# EAGLE design mini-meter-revb (EAGLE 6.5.0)
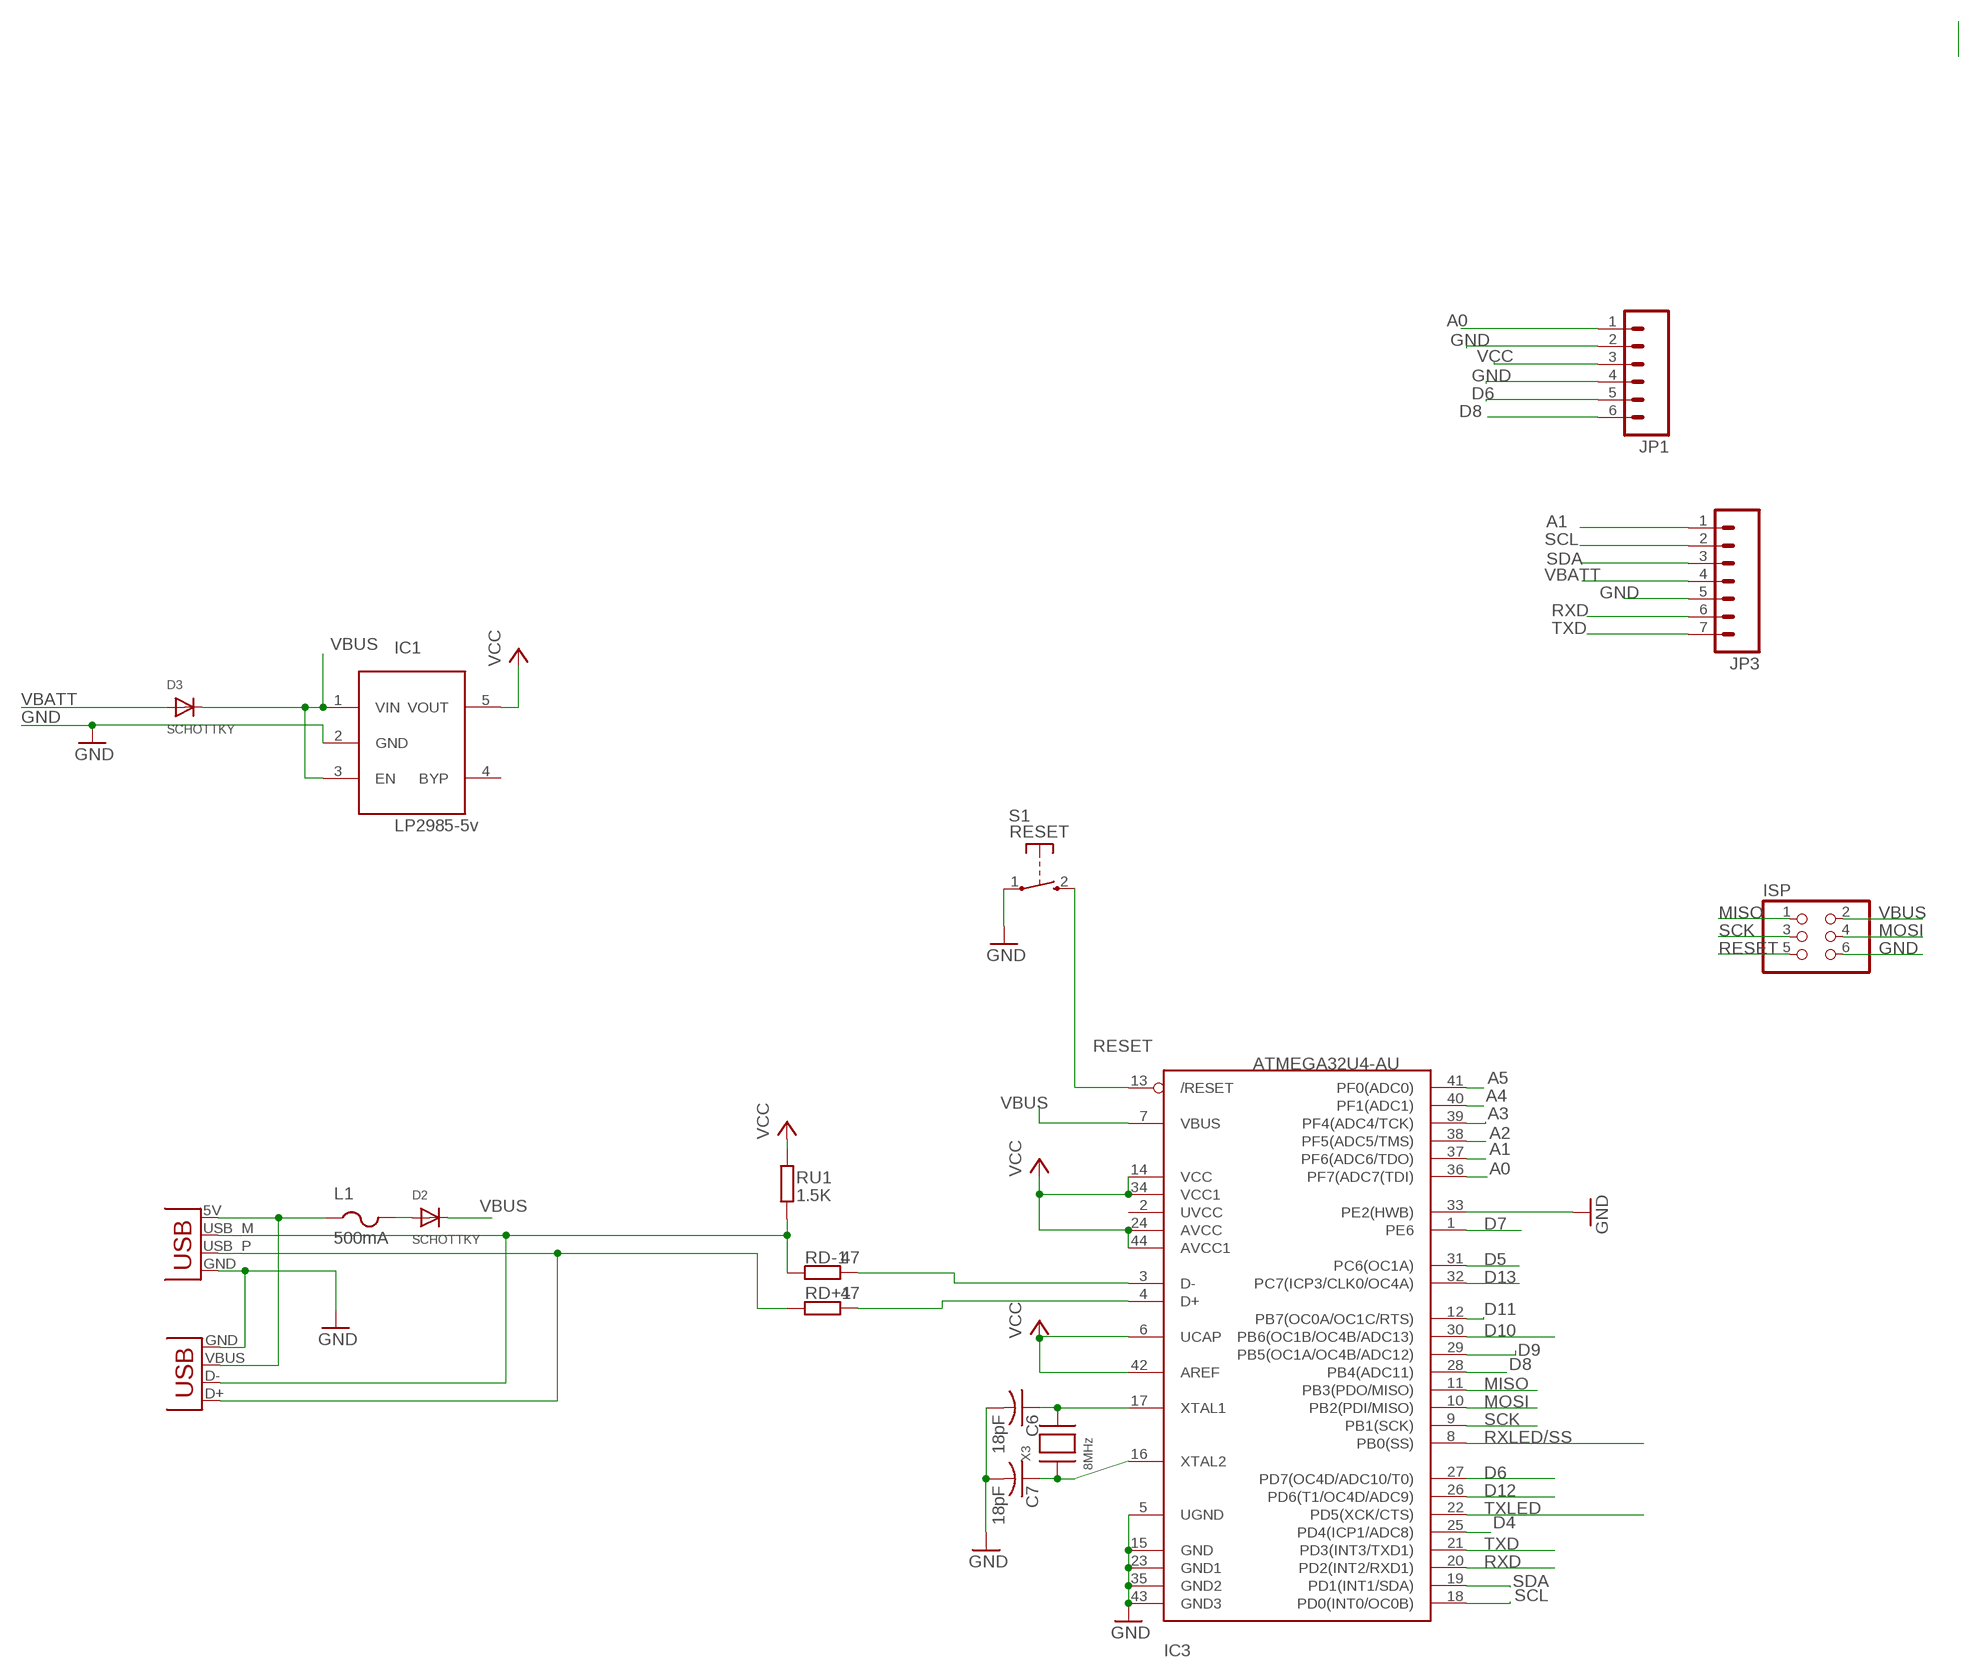
[diagram p0: schematic, sheet 1]

## Parts
C6  18pF  C-USC0805K  [C0805K]
C7  18pF  C-USC0805K  [C0805K]
D2  SCHOTTKY  DIODESOD-123  [SOD-123]
D3  SCHOTTKY  DIODESOD-123  [SOD-123]
IC1  LP2985-5v  LP298XS  [SOT23-5L]
IC3  ATMEGA32U4-AU  [TQFP44]
ISP  PINHD-2X3  [2X03]
JP1  M06LOCK  [1X06_LOCK]
JP3  M07LOCK  [1X07_LOCK]
L1  500mA  PTCFUSE-1206  [R1206]
P1  USBPCB  [USB-A-PCB]
RD+1  47  R-EU_R0805  [R0805]
RD-1  47  R-EU_R0805  [R0805]
RU1  1.5K  R-EU_R0805  [R0805]
S1  RESET  TAC_SWITCH_2PIN  [TACTILE_SWITCH_SMD_2PIN_TINY]
X2  USBSMD  [USB-MINIB]
X3  8MHz  XTALNX5032  [NX5032]

## Nets
A0: IC3.36(PF7(ADC7(TDI)) JP1.1
A1: IC3.37(PF6(ADC6/TDO)) JP3.1
A2: IC3.38(PF5(ADC5/TMS))
A3: IC3.39(PF4(ADC4/TCK))
A4: IC3.40(PF1(ADC1))
A5: IC3.41(PF0(ADC0))
D4: IC3.25(PD4(ICP1/ADC8))
D5: IC3.31(PC6(OC1A))
D6: IC3.27(PD7(OC4D/ADC10/T0)) JP1.5
D7: IC3.1(PE6)
D8: IC3.28(PB4(ADC11)) JP1.6
D9: IC3.29(PB5(OC1A/OC4B/ADC12))
D10: IC3.30(PB6(OC1B/OC4B/ADC13))
D11: IC3.12(PB7(OC0A/OC1C/RTS))
D12: IC3.26(PD6(T1/OC4D/ADC9))
D13: IC3.32(PC7(ICP3/CLK0/OC4A))
D-: P1.USB_M(D-) RD-1.1 RU1.1 X2.D-
GND: C6.2 C7.2 IC1.2(GND) IC3.5(UGND) IC3.15(GND) IC3.23(GND1) IC3.33(PE2(HWB)) IC3.35(GND2) IC3.43(GND3) ISP.6 JP1.2 JP1.4 JP3.5 P1.GND S1.1(P) X2.GND
MISO: IC3.11(PB3(PDO/MISO)) ISP.1
MOSI: IC3.10(PB2(PDI/MISO)) ISP.4
N$1: D2.A L1.2
N$2: C7.1 IC3.16(XTAL2) X3.P$1
N$3: C6.1 IC3.17(XTAL1) X3.P$2
N$4: P1.USB_P(D+) RD+1.1 X2.D+
N$21: IC3.4(D+) RD+1.2
N$22: IC3.3(D-) RD-1.2
RESET: IC3.13(/RESET) ISP.5 S1.2(S)
RXD: IC3.20(PD2(INT2/RXD1)) JP3.6
RXLED/SS: IC3.8(PB0(SS))
SCK: IC3.9(PB1(SCK)) ISP.3
SCL: IC3.18(PD0(INT0/OC0B)) JP3.2
SDA: IC3.19(PD1(INT1/SDA)) JP3.3
TXD: IC3.21(PD3(INT3/TXD1)) JP3.7
TXLED: IC3.22(PD5(XCK/CTS))
VBATT: D3.A JP3.4
VBUS: D2.C D3.C IC1.1(VIN) IC1.3(EN) IC3.7(VBUS) ISP.2
VBUS1: L1.1 P1.5V(VBUS) X2.VBUS
VCC: IC1.5(VOUT) IC3.6(UCAP) IC3.14(VCC) IC3.24(AVCC) IC3.34(VCC1) IC3.42(AREF) IC3.44(AVCC1) JP1.3 RU1.2
Unconnected: IC1.4(BYP) IC3.2(UVCC)

## Library data of the parts
C6 C7 = adafruit:C-US: CAPACITOR, American symbol
D2 D3 = adafruit:DIODE: Diode SMADIODE - SMA Surface Mount Package 20V 1A Schottky Diode Digikey: 641-1014-6-ND DO-1N4148 - Through Hole Small Current Diode SOD-123 20V 1 A (.5mV Vf) Schottky Diode - Digikey: MBRX120TPMSCT-ND SOD-323 10V 570mA (.38mV Vf, 3ns) Schottky Diode - Digikey: ZLLS410CT-ND SOD-523 30V 30mA Schottky Diode (RB751S-40TE61) - Digikey: RB751S-40TE61CT-ND SOT23-R/W - SOT23 Package (R = Solder Paste/Reflow Ovens, W = Hand-Soldering) BAT54Film 40V 300mA - Digikey: 497-7162-1-ND
IC1 = adafruit:LP298X
IC3 = adaprog:ATMEGA32U4
ISP = pinhead:PINHD-2X3: PIN HEADER
JP1 = SparkFun-Connectors:M06: Header 6 Standard 6-pin 0.1" header. Use with straight break away headers (SKU : PRT-00116), right angle break away headers (PRT-00553), swiss pins (PRT-00743), machine pins (PRT-00117), and female headers (PRT-00115). Molex polarized connector foot print use with SKU : PRT-08094 with associated crimp pins and housings. NOTES ON THE VARIANTS LOCK and LOCK_LONGPADS... This footprint was designed to help hold the alignment of a through-hole component (i.e. 6-pin header) while soldering it into place. You may notice that each hole has been shifted either up or down by 0.005 of an inch from it's more standard position (which is a perfectly straight line). This slight alteration caused the pins (the squares in the middle) to touch the edges of the holes. Because they are alternating, it causes a "brace" to hold the component in place. 0.005 has proven to be the perfect amount of "off-center" position when using our standard breakaway headers. Although looks a little odd when you look at the bare footprint, once you have a header in there, the alteration is very hard to notice. Also,if you push a header all the way into place, it is covered up entirely on the bottom side. This idea of altering the position of holes to aid alignment will be further integrated into the Sparkfun Library for other footprints. It can help hold any component with 3 or more connection pins.
JP3 = SparkFun-Connectors:M07: Header 7 Standard 7-pin 0.1" header. Use with straight break away headers (SKU : PRT-00116), right angle break away headers (PRT-00553), swiss pins (PRT-00743), machine pins (PRT-00117), and female headers (PRT-00115). NOTES ON THE VARIANTS LOCK and LOCK_LONGPADS... This footprint was designed to help hold the alignment of a through-hole component (i.e. 7-pin header) while soldering it into place. You may notice that each hole has been shifted either up or down by 0.005 of an inch from it's more standard position (which is usually a perfectly straight line). This slight alteration caused the pins (the squares in the middle) to touch the edges of the holes. Because they are alternating, it causes a "brace" to hold the header in place. 0.005 has proven to be the perfect amount of "off-center" position when using our standard breakaway headers. Although looks a little odd when you look at the bare footprint, once you have a header in there, the alteration is very hard to notice. Also, if you push a header all the way into place, it is covered up entirely on the bottom side. This idea of altering the position of holes to aid alignment will be further integrated into the Sparkfun Library for other footprints. It can help hold any component with 3 or more connection pins.
L1 = adafruit:PTCFUSE: PTC fuses, resettable thermistors
P1 = freetronics-master-v1:USB: USB Connectors USB-B-PTH is fully proven SKU : PRT-00139 USB-miniB is fully proven SKU : PRT-00587 USB-A-PCB is untested. USB-A-H is throughly reviewed, but untested. Spark Fun Electronics SKU : PRT-00437 USB-B-SMT is throughly reviewed, but untested. Needs silkscreen touching up. USB-A-S has not been used/tested USB-MB-H has not been used/tested
RD+1 RD-1 RU1 = rcl:R-EU_: RESISTOR, European symbol
S1 = freetronics-master-v1:TAC_SWITCH_2PIN: Momentary Tactile Switch - 2 pin
X2 = SparkFun:USB: USB Connectors USB-B-PTH is fully proven SKU : PRT-00139 USB-miniB is fully proven SKU : PRT-00587 USB-A-PCB is untested. USB-A-H is throughly reviewed, but untested. Spark Fun Electronics SKU : PRT-00437 USB-B-SMT is throughly reviewed, but untested. Needs silkscreen touching up. USB-A-S has not been used/tested USB-MB-H has not been used/tested
X3 = adaprog:XTAL

## Net classes
0 default: width 0.152 mm, drill 0.241 mm, clearance 0.152 mm
1 power: width 0.813 mm, clearance 0.203 mm

## Board
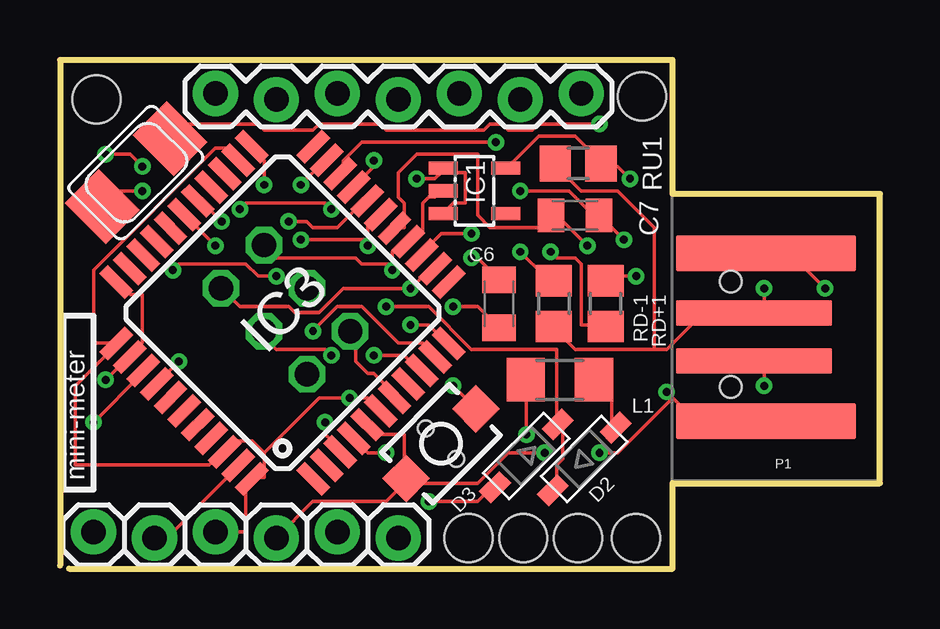
[diagram p1: board, top side]
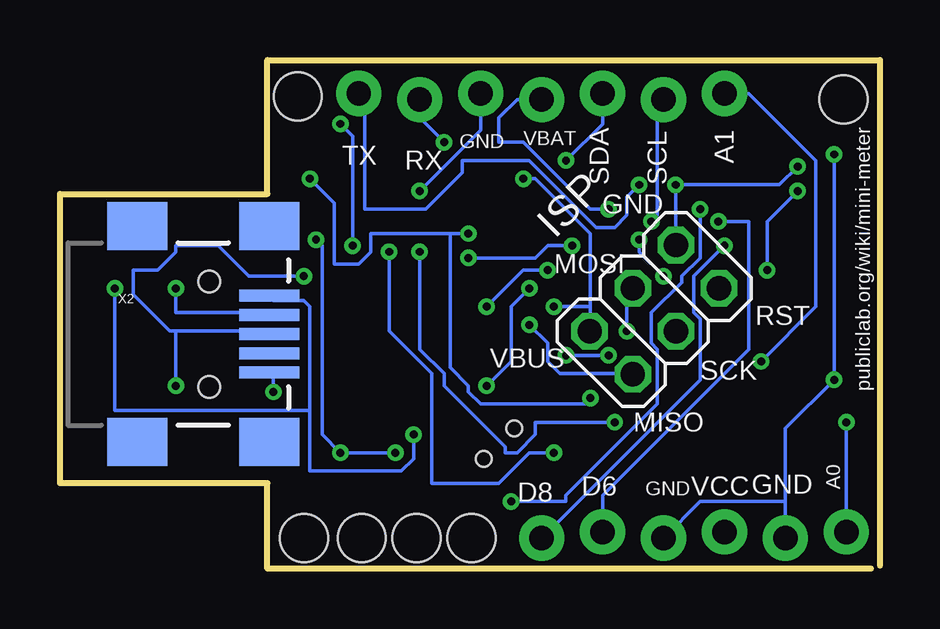
[diagram p2: board, bottom side, seen from below]

Size 34.16 x 21.21 mm. Coordinates in mm from the lower left corner, seen from the top.
Outline: 0.38,0 25.53,0 25.53,3.56 34.16,3.56 34.16,15.62 25.53,15.62 25.53,21.21 0,21.21 0,0.13
Copper layers (1*16): Top 0.0356mm / dielectric 1.5011mm / Bottom 0.0356mm
Design rules "LaenPCBOrder": minimum track width 6mil, minimum drill 13mil, track to track 6mil, track to pad 6mil, pad to pad 6mil, via to via 6mil, smd to smd 6mil, copper to edge 15mil, drill to drill 6mil, minimum pad ring 7mil, minimum via ring 7mil, stop-mask expansion 3mil, vias tented up to drill 0mil, thermal gap 10mil
Holes 2 mm at 21.59,1.27 19.3,1.27 24.26,19.69 24,1.27 1.52,19.56 17.02,1.27

### Footprints (pad centres in the part's own frame; a part is rotated, then mirrored left to right if it is on the bottom)
C0805K = smd 1.1 x 1.4: 1 -1,0; 2 1,0
SOD-123 = smd 1.2 x 0.7: A 1.85,0; C -1.85,0
SOT23-5L = smd 0.55 x 1.2: 1 -0.95,-1.3; 2 0,-1.3; 3 0.95,-1.3; 4 0.95,1.3; 5 -0.95,1.3
TQFP44 = smd 1.5 x 0.5: 1 -5.8,4; 2 -5.8,3.2; 3 -5.8,2.4; 4 -5.8,1.6; 5 -5.8,0.8; 6 -5.8,0; 7 -5.8,-0.8; 8 -5.8,-1.6; 9 -5.8,-2.4; 10 -5.8,-3.2; 11 -5.8,-4; 23 5.8,-4; 24 5.8,-3.2; 25 5.8,-2.4; 26 5.8,-1.6; 27 5.8,-0.8; 28 5.8,0; 29 5.8,0.8; 30 5.8,1.6; 31 5.8,2.4; 32 5.8,3.2; 33 5.8,4 | smd 0.5 x 1.5: 12 -4,-5.8; 13 -3.2,-5.8; 14 -2.4,-5.8; 15 -1.6,-5.8; 16 -0.8,-5.8; 17 0,-5.8; 18 0.8,-5.8; 19 1.6,-5.8; 20 2.4,-5.8; 21 3.2,-5.8; 22 4,-5.8; 34 4,5.8; 35 3.2,5.8; 36 2.4,5.8; 37 1.6,5.8; 38 0.8,5.8; 39 0,5.8; 40 -0.8,5.8; 41 -1.6,5.8; 42 -2.4,5.8; 43 -3.2,5.8; 44 -4,5.8
2X03 = drill 1.016 octagon: 1 -2.54,-1.27; 2 -2.54,1.27; 3 0,-1.27; 4 0,1.27; 5 2.54,-1.27; 6 2.54,1.27
1X06_LOCK = drill 1.016 pad 1.88: 1 0,0; 2 2.54,-0.254; 3 5.08,0; 4 7.62,-0.254; 5 10.16,0; 6 12.7,-0.254
1X07_LOCK = drill 1.016 pad 1.88: 1 0,0.127; 2 2.54,-0.127; 3 5.08,0.127; 4 7.62,-0.127; 5 10.16,0.127; 6 12.7,-0.127; 7 15.24,0.127
R1206 = smd 1.6 x 1.803: 1 -1.422,0; 2 1.422,0
USB-A-PCB = smd 7.5 x 1.5: 5V -0.2,-3.5; GND -0.2,3.5 | smd 6.5 x 1.067: USB_M 0.3,-1; USB_P 0.3,1
R0805 = smd 1.3 x 1.5: 1 -0.95,0; 2 0.95,0
TACTILE_SWITCH_SMD_2PIN_TINY = smd 1.4 x 1.4: 1 -2.05,0; 2 2.05,0 | hole 0.65: 0,0.9; 0,-0.9
USB-MINIB = smd 2.5 x 0.5: D+ 2.5,0; D- 2.5,0.8; GND 2.5,-1.6; ID 2.5,-0.8; VBUS 2.5,1.6 | smd 2.5 x 2: GND@1 -3,-4.5; GND@2 -3,4.5; GND@3 2.5,4.5; GND@4 2.5,-4.5 | hole 0.9: 0,2.2; 0,-2.2
NX5032 = smd 2 x 2.4: P$1 2,0; P$2 -2,0

### Placement (x,y rotation side)
C6  18.29,11.05 270 top
C7  21.46,14.73 0 top
D2  21.84,4.57 45 top
D3  19.43,4.7 225 top
IC1  17.27,15.75 270 top
IC3  9.27,10.67 135 top
ISP  9.4,10.79 45 bottom
JP1  1.4,1.52 0 top
JP3  6.48,19.69 0 top
L1  20.83,7.87 0 top
P1  29.21,9.65 180 top
RD+1  22.73,11.05 270 top
RD-1  20.57,11.05 90 top
RU1  21.59,16.89 0 top
S1  15.88,5.21 45 top
X2  27.94,9.78 0 bottom
X3  3.18,16.51 45 top

### Tracks (layer width: path | path; a pad name or v marks a point on that pad's centre or on a via)
A0  (via drill 0.33)
  Top 0.152: v1.4,6.1 3.43,8.13 IC3.36
  Bottom 0.152: JP1.1 v1.4,6.1
A1  (via drill 0.33)
  Top 0.152: v4.95,8.64 4.19,7.87 IC3.37
  Bottom 0.152: v4.95,8.64 2.67,10.92 2.67,17.02 5.46,19.81 JP3.1
D6  (via drill 0.33)
  Top 0.152: v6.73,14.48 5.97,15.24 IC3.27
  Bottom 0.152: v6.73,14.48 5.46,14.48 5.46,9.14 11.56,3.05 JP1.5
D8  (via drill 0.33)
  Top 0.152: v6.48,13.46 5.21,14.73 IC3.28
  Bottom 0.152: v6.48,13.46 7.75,12.19 7.75,10.67 7.49,10.41 7.49,7.87 JP1.6
D-  (via drill 0.33)
  Top 0.152: 24.77,9.14 25.27,9.14 26.54,10.41 28.83,10.41 P1.USB_M 29.08,10.67 29.34,10.67 v29.34,11.68 | 24.77,9.14 21.46,9.14 20.7,9.91 RD-1.1 | 24.77,9.14 24.77,14.22 23.24,15.75 21.72,15.75 20.7,16.76 RU1.1
  Bottom 0.152: v29.34,11.68 29.34,10.67 25.53,10.67 X2.D-
GND  (via drill 0.33)
  Top 0.152: v8.51,16 8.51,17.02 8,17.53 IC3.23 | IC1.2 15.88,15.75 15.62,15.49 15.37,15.49 15.11,15.24 15.11,13.97 14.86,13.97 14.61,13.72 IC3.15 14.35,13.46 14.1,13.21 13.84,13.21 13.84,12.7 | v16.38,10.92 17.4,10.92 18.16,10.16 C6.2 | 13.84,12.7 12.57,12.7 12.32,12.95 9.02,12.95 8.51,13.46 ISP.6 | 13.84,12.7 v13.84,12.45 | S1.1 14.35,3.81 14.35,5.59 13.08,5.59 12.83,5.84 IC3.5 | JP1.4 10.54,2.79 13.59,2.79 14.35,3.56 S1.1 | IC3.33 2.41,11.94 2.92,11.43 3.43,11.43 3.43,9.4 2.92,8.89 IC3.35 2.67,8.64 v1.91,7.87 | JP1.2 4.45,1.27 7.24,4.06 IC3.43 | v3.43,16.76 2.92,17.27 v1.91,17.27 | v19.18,15.75 21.21,15.75 22.23,14.73 C7.2 22.48,14.73 v23.5,13.72 | 25.53,7.11 26.29,6.35 29.34,6.35 P1.GND | 25.53,7.11 v25.27,7.37 | v22.48,4.83 23.24,4.83 25.53,7.11 | v20.19,4.83 18.67,4.83 17.4,3.56 14.61,3.56 S1.1
  Bottom 0.152: ISP.6 8.51,13.72 v8.51,16 4.19,16 v3.43,16.76 | v16.38,10.92 14.86,12.45 v13.84,12.45 | JP1.2 3.94,2.79 | 3.94,2.79 3.94,5.84 v1.91,7.87 v1.91,17.27 | JP1.4 7.49,2.79 3.94,2.79 | v19.18,15.75 16.64,18.29 JP3.5 | v25.27,7.37 25.27,8.13 X2.GND | v23.5,13.72 23.24,13.46 23.24,5.59 v22.48,4.83 v20.19,4.83
MISO  (via drill 0.33)
  Top 0.152: v14.61,10.16 15.37,10.16 16.13,9.4 IC3.11
  Bottom 0.152: v14.61,10.16 13.84,9.4 13.84,8.64 13.34,8.13 10.54,8.13 ISP.1
MOSI  (via drill 0.33)
  Top 0.152: v10.54,9.91 11.56,10.92 12.57,10.92 14.1,9.4 15.11,9.4 15.62,8.89 IC3.10
  Bottom 0.152: v10.54,9.91 10.54,11.68 ISP.4
N$1
  Top 0.152: L1.2 22.99,7.87 22.99,6.1 D2.A
N$2  (via drill 0.33)
  Top 0.152: IC3.16 14.1,14.22 14.35,14.22 14.35,15.24 14.1,15.49 14.1,16.51 14.86,17.27 17.4,17.27 17.4,14.73 17.91,14.22 19.94,14.22 20.45,14.73 C7.1 20.7,14.73 v21.97,13.46 | X3.P$1 5.21,18.54 8.26,18.54 8.51,18.29 10.54,18.29 10.8,18.54 13.34,18.54 13.59,18.29 17.65,18.29 17.91,18.54 18.41,18.54 18.67,18.29 19.69,18.29 19.94,18.54 v22.48,18.54
  Bottom 0.152: v22.48,18.54 21.97,18.03 v21.97,13.46
N$3  (via drill 0.33)
  Top 0.152: v17.15,12.95 17.4,12.95 18.16,12.19 C6.1 | 12.83,13.72 12.83,14.48 13.08,14.48 IC3.17 | X3.P$2 2.41,15.75 v3.43,15.75 | v4.7,12.45 4.95,12.7 7.75,12.7 8.26,12.19 v9.02,12.19 | 12.83,13.72 v10.03,13.72 | 12.83,13.72 v12.83,13.46
  Bottom 0.152: v17.15,12.95 14.35,12.95 13.84,13.46 v12.83,13.46 | v3.43,15.75 4.7,14.48 v4.7,12.45 | v9.02,12.19 10.03,13.21 v10.03,13.72
N$4  (via drill 0.33)
  Top 0.152: v24,12.19 22.73,12.19 RD+1.1 | v29.34,7.62 29.34,8.64 29.08,8.64 P1.USB_P
  Bottom 0.152: v24,12.19 26.29,12.19 27.56,13.46 29.34,13.46 29.34,13.21 30.1,12.45 31.12,12.45 31.12,11.43 29.59,9.91 29.34,9.91 | 29.34,9.91 25.53,9.91 X2.D+ | v29.34,7.62 29.34,9.91
N$21  (via drill 0.33)
  Top 0.152: v13.59,4.83 12.83,4.83 12.32,5.33 IC3.4 | v20.45,13.21 20.7,12.95 21.46,12.95 21.72,12.7 21.72,10.16 22.73,10.16 RD+1.2
  Bottom 0.152: v13.59,4.83 14.61,4.83 15.88,3.56 18.67,3.56 18.67,8.13 20.45,9.91 v20.45,13.21
N$22  (via drill 0.33)
  Top 0.152: v11.05,6.1 11.05,5.59 11.56,5.08 IC3.3 | v19.18,13.21 20.19,12.19 20.45,12.19 RD-1.2
  Bottom 0.152: v11.05,6.1 14.35,6.1 14.35,5.59 15.11,4.83 15.62,4.83 15.62,5.08 18.16,7.62 18.16,8.13 19.18,9.14 v19.18,13.21
RESET  (via drill 0.33)
  Top 0.152: v16.38,7.62 17.15,6.86 S1.2 | IC3.13 15.62,12.45 15.37,12.45 v14.61,11.68 11.81,11.68 10.8,10.67 9.78,10.67 9.52,10.92 7.49,10.92 6.73,11.68 ISP.5
  Bottom 0.152: v16.38,7.62 15.37,8.64 15.37,10.92 v14.61,11.68
RXD  (via drill 0.33)
  Top 0.152: v18.16,17.78 12.57,17.78 11.81,17.02 11.81,16.51 IC3.20
  Bottom 0.152: v18.16,17.78 19.18,18.8 JP3.6
SCK  (via drill 0.33)
  Top 0.152: v13.08,8.89 14.35,8.89 14.86,8.38 IC3.9 | v11.3,8.89 11.05,9.14 9.02,9.14 8.51,9.65 ISP.3
  Bottom 0.152: v11.3,8.89 v13.08,8.89
SCL  (via drill 0.33)
  Top 0.152: v9.52,14.48 10.29,14.48 10.54,14.22 11.56,14.22 12.57,15.24 IC3.18
  Bottom 0.152: v9.52,14.48 9.27,14.73 9.27,19.3 JP3.2
SDA  (via drill 0.33)
  Top 0.152: v13.08,17.02 13.08,16.76 12.32,16 IC3.19
  Bottom 0.152: v13.08,17.02 11.56,18.54 JP3.3
TXD  (via drill 0.33)
  Top 0.152: v10.03,16 11.05,17.02 IC3.21
  Bottom 0.152: v10.03,16 10.54,15.49 10.54,14.73 11.05,14.22 11.81,14.22 14.61,17.02 17.4,17.02 17.4,16.51 18.92,14.99 21.46,14.99 21.46,19.56 JP3.7
VBATT  (via drill 0.33)
  Top 0.152: v15.37,2.79 17.4,2.79 17.91,3.3 D3.A | v7.49,14.99 7.75,15.24 11.05,15.24 v11.3,14.99
  Bottom 0.152: v15.37,2.79 13.08,2.79 13.08,3.05 9.27,6.86 9.27,9.14 9.52,9.4 9.52,10.67 8.26,11.94 8.26,12.19 7.49,12.95 v7.49,14.99 | v11.3,14.99 12.07,14.99 14.86,17.78 15.88,17.78 15.88,18.8 15.11,19.56 JP3.4
VBUS  (via drill 0.33)
  Top 0.152: D2.C 20.7,3.3 20.7,4.32 20.95,4.57 20.95,5.84 D3.C 20.7,6.1 20.7,9.14 17.15,9.14 15.37,10.92 v13.59,10.92 | IC1.3 16.13,14.99 16.38,15.24 16.89,15.24 16.89,16.51 16.13,16.51 IC1.1 15.88,16.51 15.62,16.26 v14.86,16.26 | IC3.7 13.84,7.37 13.08,8.13 12.83,8.13 12.32,8.64 12.32,9.65 ISP.2
  Bottom 0.152: v14.86,16.26 14.35,16.26 12.07,13.97 12.07,10.92 | 12.07,10.92 12.07,9.91 ISP.2 | 12.07,10.92 v13.59,10.92
VBUS1  (via drill 0.33)
  Top 0.152: v19.43,5.59 19.43,7.87 L1.1 | v31.88,11.68 30.61,12.95 29.59,12.95 P1.5V
  Bottom 0.152: v19.43,5.59 19.43,4.57 19.94,4.06 23.75,4.06 23.75,6.6 | 23.75,6.6 23.75,10.92 24,11.18 25.27,11.18 X2.VBUS | 23.75,6.6 31.88,6.6 v31.88,11.68
VCC  (via drill 0.33)
  Top 0.152: IC1.5 18.67,16.76 19.94,18.03 21.46,18.03 22.48,17.02 RU1.2 22.73,16.76 23.24,16.76 v23.75,16.26 | v17.15,13.97 15.88,13.97 15.11,13.21 IC3.14 | JP1.3 7.75,1.52 7.75,3.56 IC3.44 8,3.81 8.51,3.81 8.51,4.83 | 8.51,4.83 8,5.33 7.24,5.33 6.98,5.08 IC3.42 6.73,4.83 6.22,4.32 0.64,4.32 0.64,7.62 2.16,9.14 IC3.34 2.16,9.4 1.4,9.4 1.4,12.45 6.48,17.53 6.98,17.53 7.24,17.27 IC3.24 | 8.51,4.83 10.8,7.11 v12.07,7.11 12.83,7.11 13.34,6.6 IC3.6
  Bottom 0.152: 17.91,13.97 21.21,13.97 21.21,13.21 21.72,12.7 22.73,12.7 22.73,15.24 v23.75,16.26 | 17.91,13.97 v17.15,13.97 | 17.91,13.97 17.91,8.38 17.15,7.62 17.15,7.37 16.64,6.86 12.07,6.86 v12.07,7.11

### Text on the board
tNames: mini-meter
bNames: publiclab.org/wiki/mini-meter | A1 | VBAT | GND | TX | SCL | SDA | RX | GND | MOSI | RST | SCK | VBUS | MISO | GND | A0 | VCC | GND | D6 | D8